# Altium schematic sheet KA2_1.SchDoc
size 420 x 297 mm; SheetNumber: 1; SheetTotal: 6
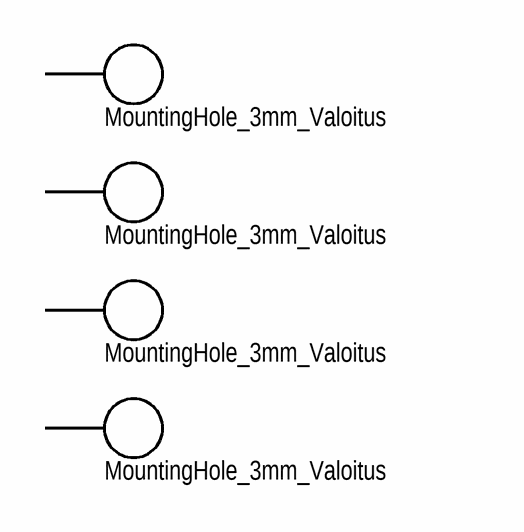
[diagram p0: KA2_1.SchDoc]

## Parts
H1  MountingHole_3mm_Valoitus  [MountingHole_Valoitus_3.2_5mm]  (no BOM)
H2  MountingHole_3mm_Valoitus  [MountingHole_Valoitus_3.2_5mm]  (no BOM)
H3  MountingHole_3mm_Valoitus  [MountingHole_Valoitus_3.2_5mm]  (no BOM)
H4  MountingHole_3mm_Valoitus  [MountingHole_Valoitus_3.2_5mm]  (no BOM)

## Nets

Not connected (* = marked no-connect by the designer): H1 1; H2 1; H3 1; H4 1

## Notes on the sheet
- Перв. примен.
- Справ. №
- Подп. дата
- Инв. № дубл.
- Взам. инв. №
- Подп. и дата
- Изм.
- Разраб.
- Лист
- № докум.
- Подп.
- Дата
- Лит.
- Масса
- Масштаб
- Пров.
- Т.контр.
- Листов
- Инв. № подл.
- Н.контр.
- Утв.
- ALTIUM GOSTBOM2.0 KEV
- Файл:
- Копировал
- Формат А3